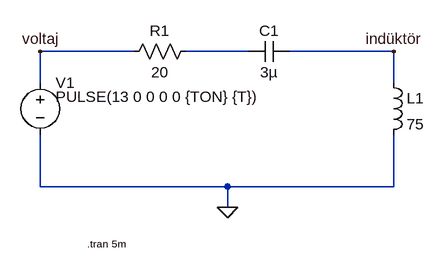
[diagram p0: schematic rlc.asc]
rlc.asc, the LTspice schematic file:
Version 4
SHEET 1 880 680
WIRE 416 256 272 256
WIRE 592 256 496 256
WIRE 816 256 656 256
WIRE 272 304 272 256
WIRE 816 304 816 256
WIRE 272 464 272 384
WIRE 560 464 272 464
WIRE 816 464 816 384
WIRE 816 464 560 464
WIRE 560 496 560 464
FLAG 560 496 0
FLAG 272 256 voltaj
FLAG 816 256 indüktör
SYMBOL voltage 272 288 R0
WINDOW 3 24 38 Left 2
SYMATTR InstName V1
SYMATTR Value PULSE(13 0 0 0 0 {TON} {T})
SYMBOL cap 656 240 R90
WINDOW 0 0 32 VBottom 2
WINDOW 3 32 32 VTop 2
SYMATTR InstName C1
SYMATTR Value 3µ
SYMBOL res 512 240 R90
WINDOW 0 0 56 VBottom 2
WINDOW 3 32 56 VTop 2
SYMATTR InstName R1
SYMATTR Value 20
SYMBOL ind 800 288 R0
SYMATTR InstName L1
SYMATTR Value 75
TEXT 344 552 Left 1 !.tran 5m

The netlist it stands for:
* rlc.asc
V1 voltaj 0 PULSE(13 0 0 0 0 {TON} {T})
C1 indüktör N001 3µ
R1 N001 voltaj 20
L1 indüktör 0 75
.tran 5m
.backanno
.end